# Altium schematic sheet Architecture.SchDoc: System Architecture
size 420 x 297 mm; SheetNumber: 1; SheetTotal: 8
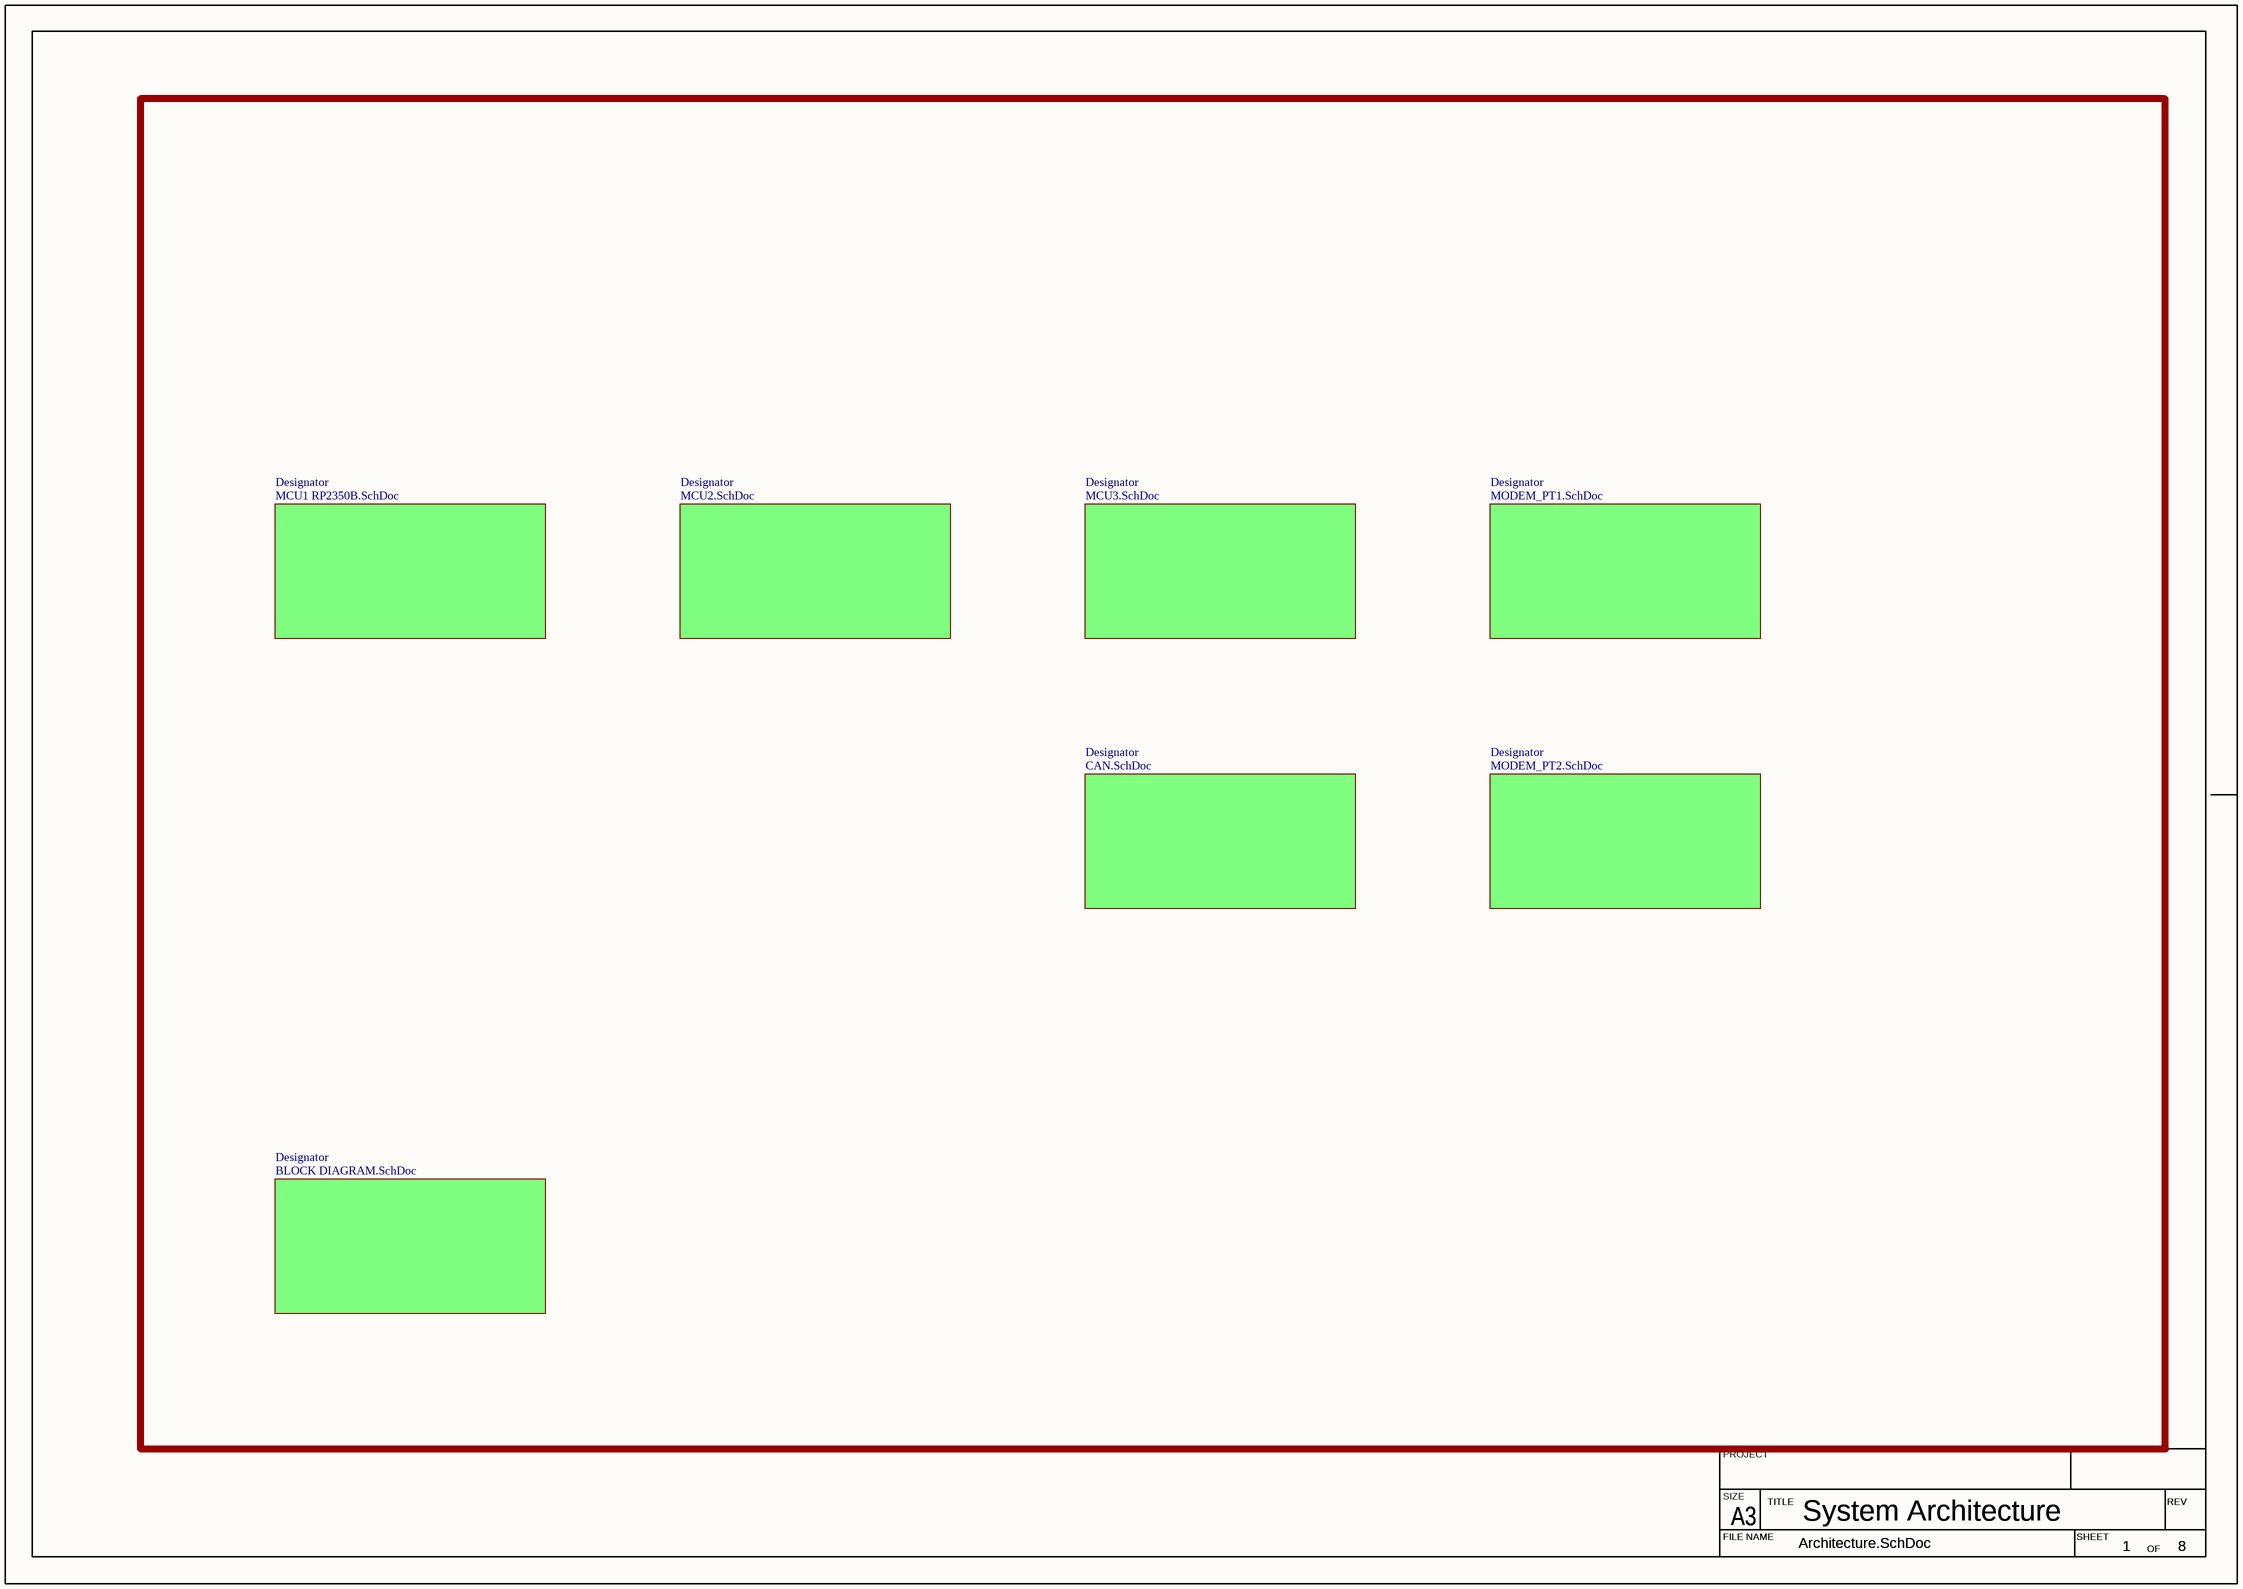
[diagram p0: Architecture.SchDoc]

## Sub-sheets
Designator = MCU1 RP2350B.SchDoc: no entries
Designator = MCU2.SchDoc: no entries
Designator = BLOCK DIAGRAM.SchDoc: no entries
Designator = MCU3.SchDoc: no entries
Designator = MODEM_PT1.SchDoc: no entries
Designator = MODEM_PT2.SchDoc: no entries
Designator = CAN.SchDoc: no entries

## Notes on the sheet
- PROJECT
- SIZE
- FILE NAME
- A3
- TITLE
- SHEET
- OF
- REV